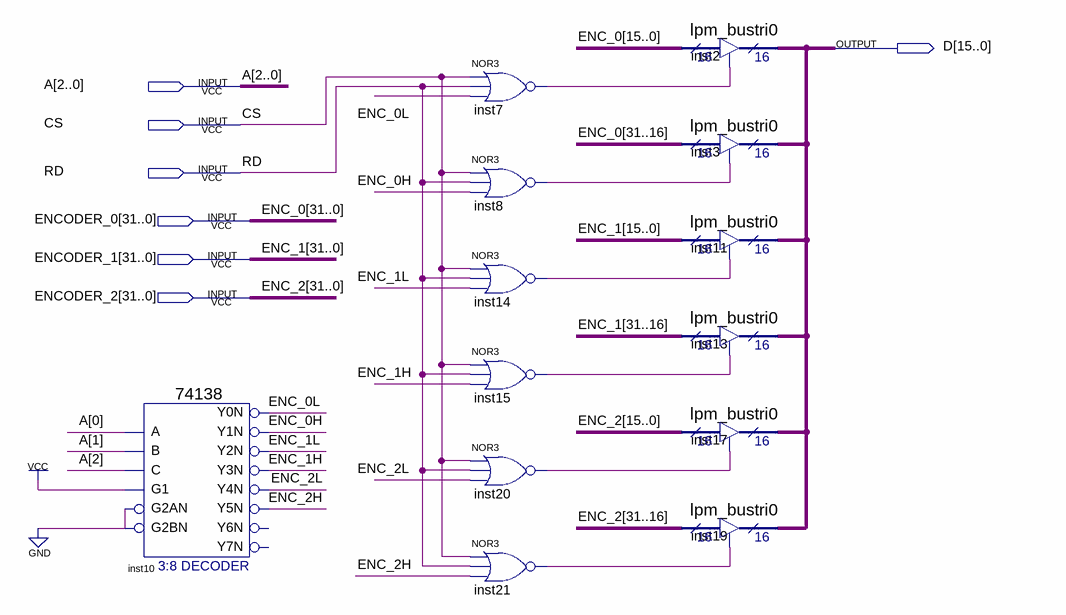
[diagram p0: schematic sheet]
// Quartus schematic read_encoder.bdf as structural Verilog: 13 symbols, 7 pins
module read_encoder (
  input  [2:0] A,
  input  CS,
  input  RD,
  input  [31:0] ENCODER_0,
  input  [31:0] ENCODER_1,
  input  [31:0] ENCODER_2,
  output [15:0] D
);

  wire ENC_0H, ENC_0L, ENC_1H, ENC_1L, ENC_2H, ENC_2L, inst7_out, inst8_out, inst14_out, inst15_out,
       inst20_out, inst21_out;

  \74138  inst10 (
    .A(A[0]), .B(A[1]), .G1(1'b1), .C(A[2]), .G2AN(1'b0), .G2BN(1'b0), .Y0N(ENC_0L), .Y1N(ENC_0H),
    .Y2N(ENC_1L), .Y3N(ENC_1H), .Y4N(ENC_2L), .Y5N(ENC_2H));  // open: Y6N, Y7N
  nor inst7 (inst7_out, CS, RD, ENC_0L);
  nor inst8 (inst8_out, CS, RD, ENC_0H);
  nor inst14 (inst14_out, CS, RD, ENC_1L);
  nor inst15 (inst15_out, CS, RD, ENC_1H);
  nor inst20 (inst20_out, CS, RD, ENC_2L);
  nor inst21 (inst21_out, CS, RD, ENC_2H);
  lpm_bustri0 inst2 (.enabledt(inst7_out), .data(ENCODER_0[15:0]), .tridata(D));
  lpm_bustri0 inst3 (.enabledt(inst8_out), .data(ENCODER_0[31:16]), .tridata(D));
  lpm_bustri0 inst11 (.enabledt(inst14_out), .data(ENCODER_1[15:0]), .tridata(D));
  lpm_bustri0 inst13 (.enabledt(inst15_out), .data(ENCODER_1[31:16]), .tridata(D));
  lpm_bustri0 inst17 (.enabledt(inst20_out), .data(ENCODER_2[15:0]), .tridata(D));
  lpm_bustri0 inst19 (.enabledt(inst21_out), .data(ENCODER_2[31:16]), .tridata(D));

  // Other names for the same wires on the sheet: ENC_0[31:0] = ENCODER_0; ENC_1[31:0] = ENCODER_1;
  //   ENC_2[31:0] = ENCODER_2
endmodule
